# Altium schematic sheet Encoder.SchDoc
size A4; SheetNumber: 4; SheetTotal: 8
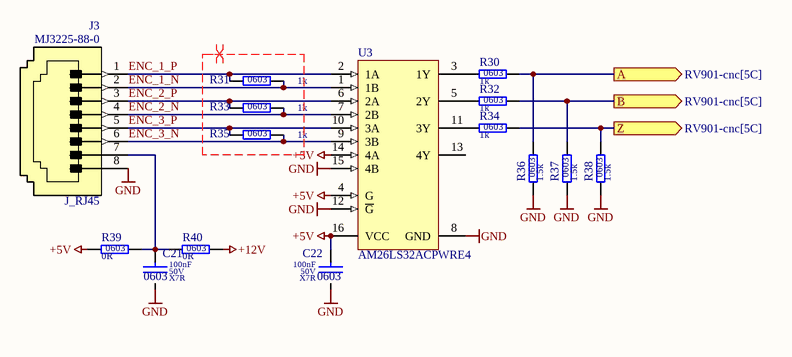
[diagram p0: Encoder.SchDoc]

## Parts
C21  value 100nF  Dielectric: X7R  Voltage: 50V  SCH_Footprint: 0603  [C_0603_1608]  (hidden comment: Ceramic X7R)
C22  value 100nF  Dielectric: X7R  Voltage: 50V  SCH_Footprint: 0603  [C_0603_1608]  (hidden comment: Ceramic X7R)
J3  value MJ3225-88-0  [J_RJ45_MJ3225-88-0]  (hidden comment: Modular Connector, Modular Jack, 1 x 1 (Port), 8P8C, Cat3)
R30  value 1k  SCH_Footprint: 0603  [R_0603_1608]  (hidden comment: Resistor)
R31  value 1k  SCH_Footprint: 0603  [R_0603_1608]  (hidden comment: Resistor)
R32  value 1k  SCH_Footprint: 0603  [R_0603_1608]  (hidden comment: Resistor)
R33  value 1k  SCH_Footprint: 0603  [R_0603_1608]  (hidden comment: Resistor)
R34  value 1k  SCH_Footprint: 0603  [R_0603_1608]  (hidden comment: Resistor)
R35  value 1k  SCH_Footprint: 0603  [R_0603_1608]  (hidden comment: Resistor)
R36  value 1.5k  SCH_Footprint: 0603  [R_0603_1608]  (hidden comment: Resistor)
R37  value 1.5k  SCH_Footprint: 0603  [R_0603_1608]  (hidden comment: Resistor)
R38  value 1.5k  SCH_Footprint: 0603  [R_0603_1608]  (hidden comment: Resistor)
R39  value 0R  SCH_Footprint: 0603  [R_0603_1608]  (hidden comment: Resistor)
R40  value 0R  SCH_Footprint: 0603  [R_0603_1608]  (hidden comment: Resistor)
U3  AM26LS32ACPWRE4  [PW16_L]

## Ports
A (out, see RV901-cnc[5C]), B (out, see RV901-cnc[5C]), Z (out, see RV901-cnc[5C])

## Nets
+5V: C22.1 R39.1 U3.4(G) U3.14(4A) U3.16(VCC)
+12V: R40.2
GND: C21.2 C22.2 J3.8 R36.1 R37.1 R38.1 U3.8(GND) U3.12(~{G}) U3.15(4B)
A: R30.2 R36.2 ; port A
B: R32.2 R37.2 ; port B
ENC_1_N: J3.2 R31.2 U3.1(1B)
ENC_1_P: J3.1 R31.1 U3.2(1A)
ENC_2_N: J3.4 R33.2 U3.7(2B)
ENC_2_P: J3.3 R33.1 U3.6(2A)
ENC_3_N: J3.6 R35.2 U3.9(3B)
ENC_3_P: J3.5 R35.1 U3.10(3A)
Z: R34.2 R38.2 ; port Z
NetC21_1: C21.1 J3.7 R39.2 R40.1
NetR30_1: R30.1 U3.3(1Y)
NetR32_1: R32.1 U3.5(2Y)
NetR34_1: R34.1 U3.11(3Y)

Not connected (* = marked no-connect by the designer): U3 13(4Y)

## Layout directives
differential pair: (no net found under the mark)

## Notes on the sheet
- (in symbol J_RJ45_MJ3225-88-0) J1; J2; J4; J5; J6; J7; J8

## Library data of the parts
C21 C22 = C_100nF_50V_X7R_0603_5: Capacitor; Manufacturer: Samsung; Manufacturer Part Number: CL10B104JB8NNNC; Tolerance (%): 5; Part Number: C_100nF_50V_X7R_0603_5; HelpURL: http://www.tme.eu/pl/Document/4a42202b32dab16128fe107dd69598cc/samsung-chip-cap.pdf; Supplier 1: TME; Supplier Part Number 1: CL10B104JB8NNNC; Supplier 2: RS Components; Supplier Part Number 2: 7665455; Supplier 3: Farnell; Supplier 4: Mouser; Supplier 5: Digi-Key; Supplier Part Number 5: 1276-1033-1-ND; Supplier 6: LCSC; Supplier Part Number 6: C24452
J3 = J_RJ45_MJ3225-88-0: Manufacturer: Global Connector Technology; SCH_Footprint: J_RJ45; Part Number: J_RJ45_MJ3225-88-0; HelpURL: https://www.farnell.com/cad/3781788.pdf; Manufacturer Part Number: MJ3225-88-0; Supplier 1: TME; Supplier 2: RS Components; Supplier 3: Farnell; Supplier Part Number 3: 4071641; Supplier 4: Mouser; Supplier 5: Digi-Key; Supplier 6: LCSC; Supplier 7: Newark; Supplier Part Number 7: 61AK4308
R30-R35 = R_1k_0603_1_AECQ0: Manufacturer: Panasonic; Manufacturer Part Number: ERJ-3EKF1001V; Voltage: 75V; Power: 100mW; Tolerance: 1%; AEC-Q: 0; Part Number: R_1k_0603_1_AECQ0; HelpURL: https://industrial.panasonic.com/cdbs/www-data/pdf/RDA0000/AOA0000C304.pdf; Supplier 1: TME; Supplier Part Number 1: ERJ3EKF1001V; Supplier 2: RS Components; Supplier 3: Farnell; Supplier Part Number 3: 2303145; Supplier 4: Mouser; Supplier Part Number 4: 667-ERJ-3EKF1001V; Supplier 5: Digi-Key; Supplier Part Number 5: P1.00KHCT-ND; Supplier 6: LCSC
R36-R38 = R_1.5k_0603_1: Manufacturer: Yageo; Manufacturer Part Number: RC0603FR-071K5L; Voltage: 50V; Power: 100mW; Tolerance: 1%; Part Number: R_1.5k_0603_1; HelpURL: https://www.tme.eu/pl/Document/d2a72e545e5c8eb7bf2a04fa97535928/rc0603yageo.pdf; Supplier 1: TME; Supplier Part Number 1: RC0603FR-071K5; Supplier 2: RS Components; Supplier 3: Farnell; Supplier Part Number 3: 9238506; Supplier 4: Mouser; Supplier Part Number 4: 603-RC0603FR-071K5L; Supplier 5: Digi-Key; Supplier Part Number 5: 311-1.50KHRCT-ND; Supplier 6: LCSC
R39 R40 = R_0R_0603_1: Manufacturer: Yageo; Manufacturer Part Number: RC0603FR-070RL; Voltage: 75V; Power: 100mW; Tolerance: 1%; Part Number: R_0R_0603_1; HelpURL: https://datasheet.octopart.com/RC0603FR-070RL-Yageo-datasheet-8328172.pdf; Supplier 1: TME; Supplier Part Number 1: RC0603FR-070RL; Supplier 2: RS Components; Supplier 3: Farnell; Supplier Part Number 3: 2309106; Supplier 4: Mouser; Supplier Part Number 4: 603-RC0603FR-070RL; Supplier 5: Digi-Key; Supplier Part Number 5: 311-0.0HRCT-ND; Supplier 6: LCSC; Supplier Part Number 6: C100044
U3 = CMP-0310-00535-1: Quadruple Differential Line Receiver, 0 TX / 4 RX, 0 to 70 degC, 16-PinTSSOP (PW), Green (RoHS & no Sb/Br); Manufacturer: Texas Instruments; SubFamily: RS-422; ICC(Max)(mA): 70; Receivers Per Package: 4; Rating: Catalog; PackageReference: PW16; PackageDescription: 16-Pin Plastic Thin Small Outline Package 5 x 4.4 mm Body ,0.65 mm Pitch; ComponentLink2URL: http://www.ti.com/lit/ml/mpds361/mpds361.pdf; DatasheetVersion: SLLS115E; # of TX/RX: 0 TX / 4 RX; Eco-Plan: Green (RoHS & no Sb/Br); ComponentLink1URL: http://www.ti.com/general/docs/lit/getliterature.tsp?genericPartNumber=AM26LS32AC&fileType=pdf; ComponentLink1Description: Datasheet; Mounting Technology: Surface Mount; ComponentLink2Description: Package Specification; PackageVersion: revG, Feb-2011; Code_JEDEC: MO-153; PartNumber: AM26LS32ACPWRE4